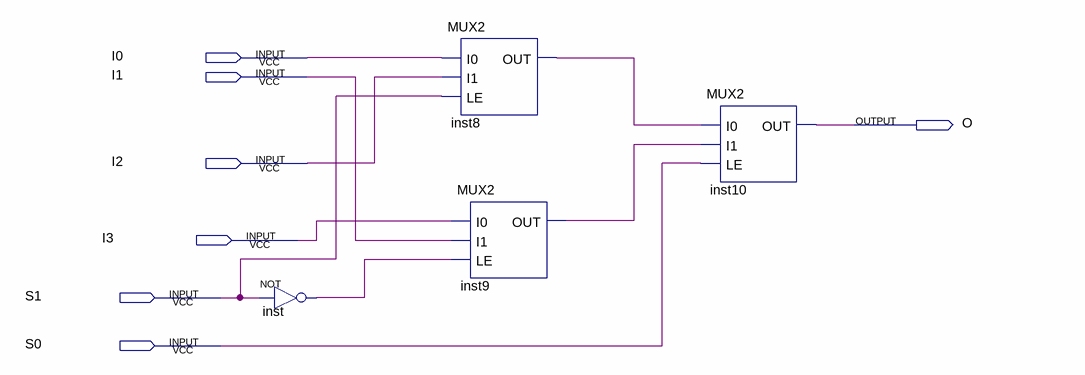
[diagram p0: schematic sheet]
// Quartus schematic mux4.bdf as structural Verilog: 4 symbols, 7 pins
module mux4 (
  input  I0,
  input  I1,
  input  I2,
  input  I3,
  input  S1,
  input  S0,
  output O
);

  wire inst8_out, inst9_out, inst_out;

  not inst (inst_out, S1);
  MUX2 inst8 (.I0(I0), .I1(I2), .LE(S1), .OUT(inst8_out));
  MUX2 inst9 (.I0(I3), .I1(I1), .LE(inst_out), .OUT(inst9_out));
  MUX2 inst10 (.I0(inst8_out), .I1(inst9_out), .LE(S0), .OUT(O));
endmodule
